# Altium project PCB1_Left Leg.PrjPcb
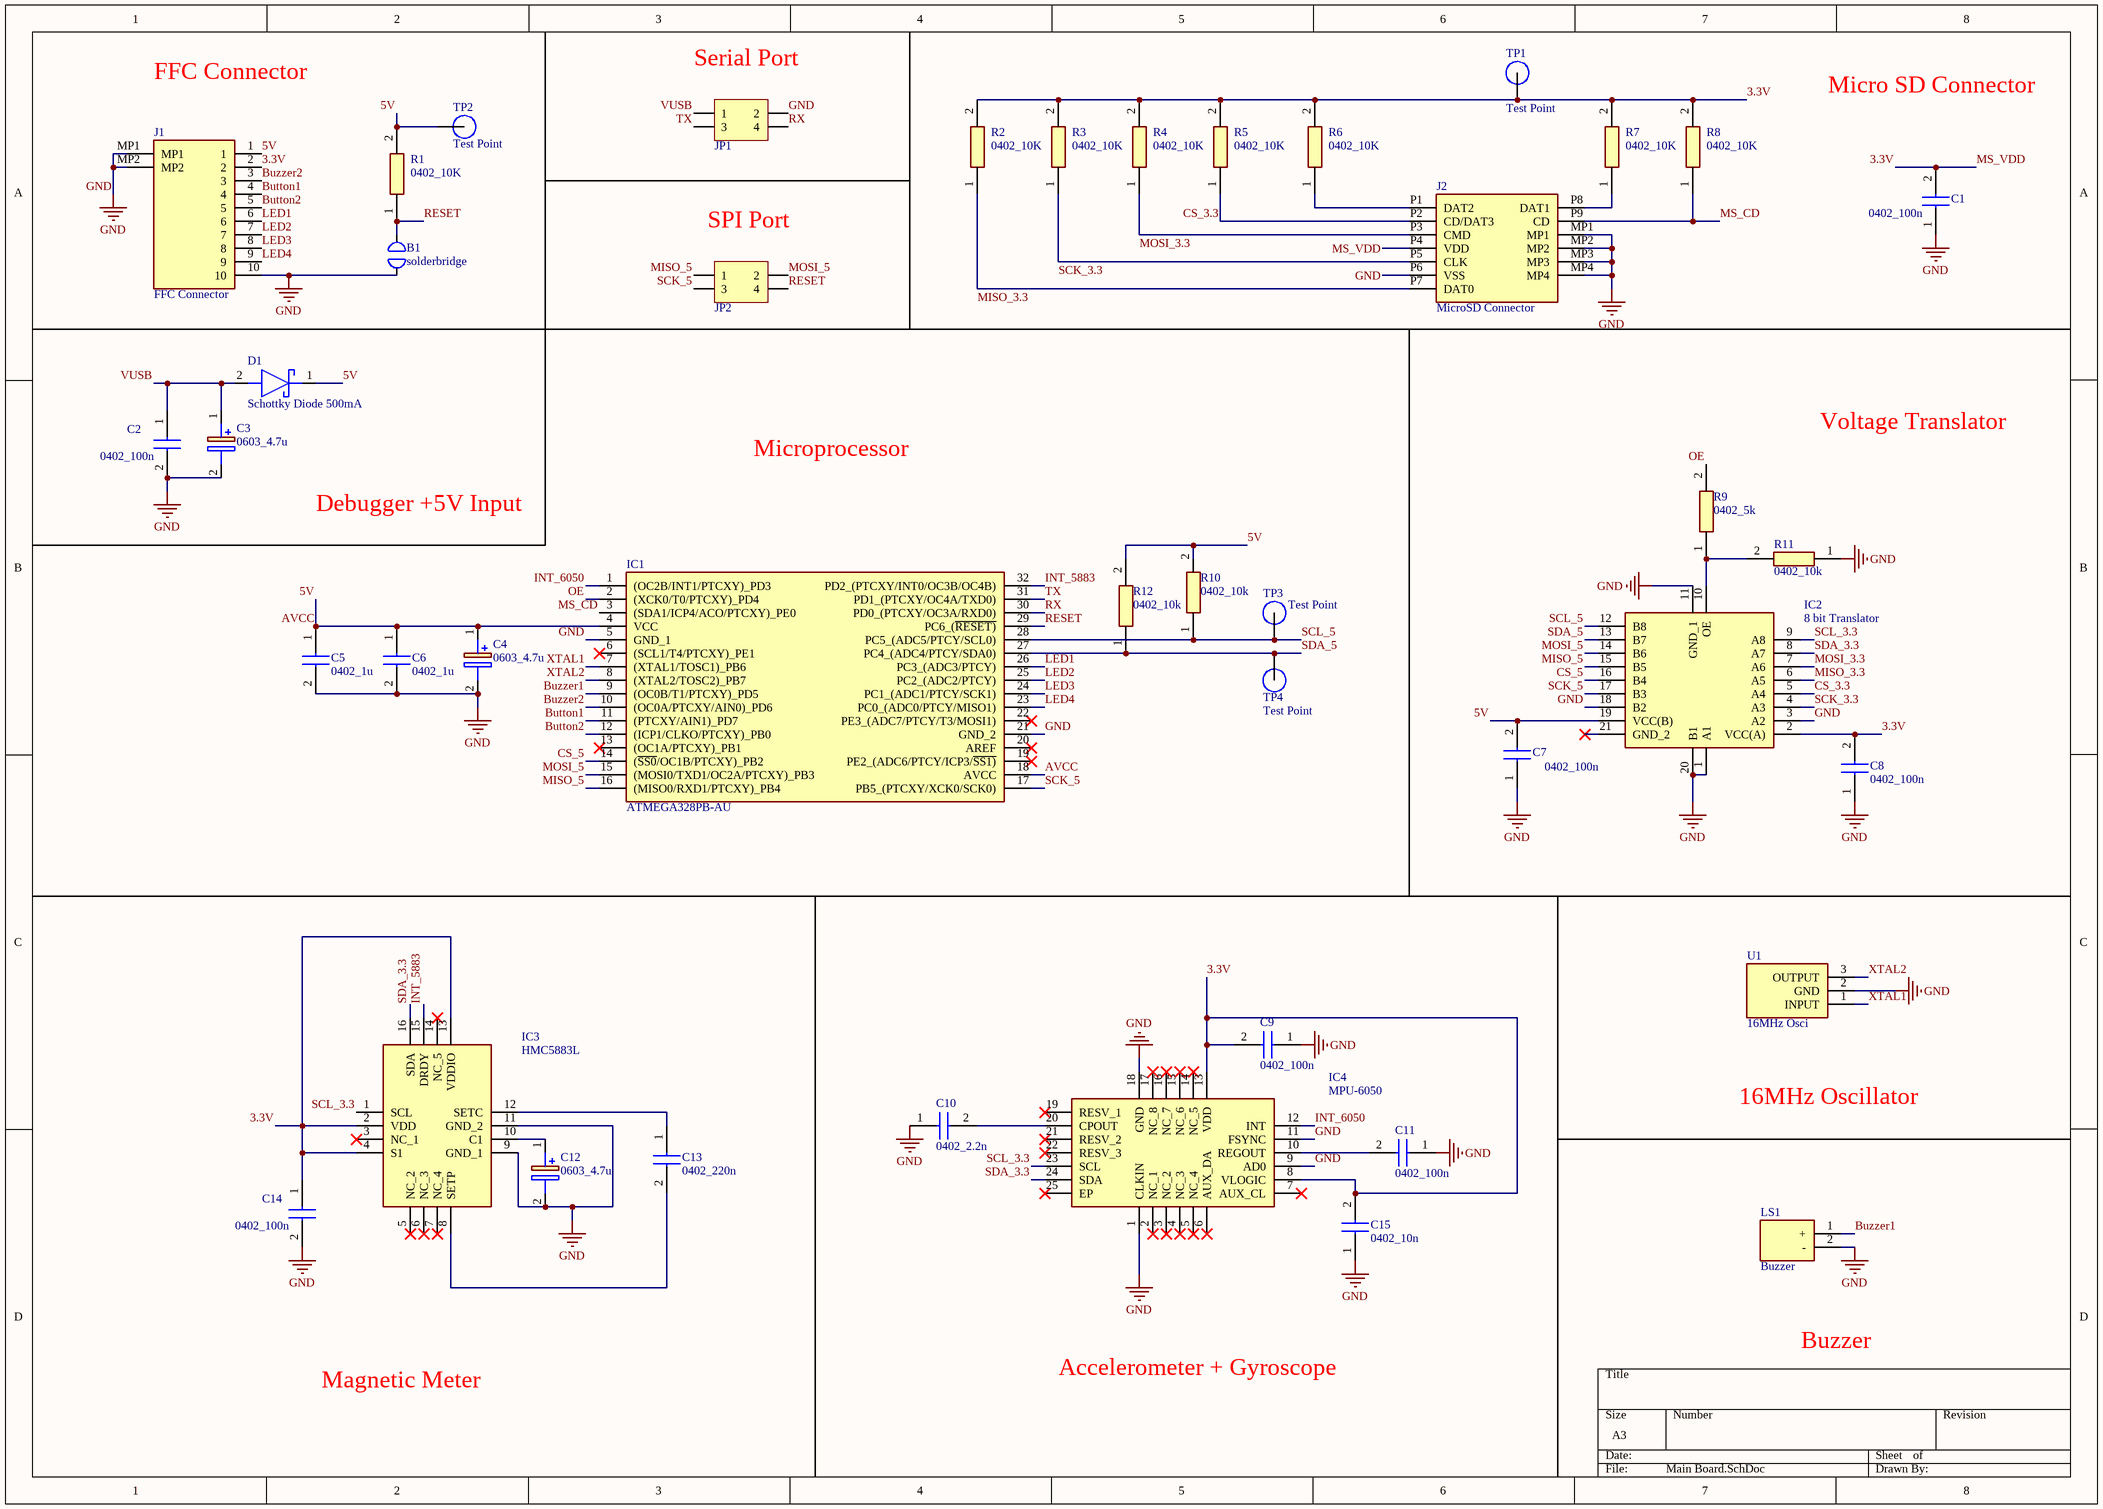
[diagram p0: Main Board.SchDoc]
1 sheet, 43 parts. Net scope: global (net labels, ports and power ports of the same name join across sheets).
Board file: PCB1_Left Leg.PcbDoc

## Sheet Main Board.SchDoc
size A3

### Parts
B1  solderbridge  [Solderbridge]
C1  0402_100n  [CAPC1005X55N]
C2  0402_100n  [CAPC1005X55N]
C3  0603_4.7u  [CAPPM168X90N]
C4  0603_4.7u  [CAPPM168X90N]
C5  0402_1u  [CAPC1005X55N]
C6  0402_1u  [CAPC1005X55N]
C7  0402_100n  [CAPC1005X55N]
C8  0402_100n  [CAPC1005X55N]
C9  0402_100n  [CAPC1005X55N]
C10  0402_2.2n  [CAPC1005X55N]
C11  0402_100n  [CAPC1005X55N]
C12  0603_4.7u  [CAPPM168X90N]
C13  0402_220n  [CAPC1005X55N]
C14  0402_100n  [CAPC1005X55N]
C15  0402_10n  [CAPC1005X55N]
D1  Schottky Diode 500mA  [DIOC1709X85N]
IC1  ATMEGA328PB-AU  [QFP80P900X900X120-32N]
IC2  8 bit Translator  [NXB0108BQX]
IC3  HMC5883L  [HMC5883L]
IC4  MPU-6050  [MPU_6050]
J1  FFC Connector  [528921033]
J2  MicroSD Connector  [MEM20750014001A]
JP1  Header2X2  [HDR2.54-LI-2x2P]  (value not drawn)
JP2  Header2X2  [HDR2.54-LI-2x2P]  (value not drawn)
LS1  Buzzer  [CPT1212381SMTTR]
R1  0402_10K  [0402_R]
R2  0402_10K  [0402_R]
R3  0402_10K  [0402_R]
R4  0402_10K  [0402_R]
R5  0402_10K  [0402_R]
R6  0402_10K  [0402_R]
R7  0402_10K  [0402_R]
R8  0402_10K  [0402_R]
R9  0402_5k  [0402_R]
R10  0402_10k  [0402_R]
R11  0402_10k  [0402_R]
R12  0402_10k  [0402_R]
TP1  Test Point  [TP_SMD_D1.0mm]
TP2  Test Point  [TP_SMD_D1.0mm]
TP3  Test Point  [TP_SMD_D1.0mm]
TP4  Test Point  [TP_SMD_D1.0mm]
U1  16MHz Osci  [CSTNE16M0V530000R0]

### Nets
GND: B1.2 C1.1 C2.2 C3.2(-) C4.2(-) C5.2 C6.2 C7.1 C8.1 C9.1 C10.1 C11.1 C12.2(-) C14.2 C15.1 IC1.5(GND_1) IC1.21(GND_2) IC2.1(A1) IC2.3(A2) IC2.11(GND_1) IC2.18(B2) IC2.20(B1) IC3.9(GND_1) IC3.11(GND_2) IC4.1(CLKIN) IC4.9(AD0) IC4.11(FSYNC) IC4.18(GND) J1.10 J1.MP1 J1.MP2 J2.MP1 J2.MP2 J2.MP3 J2.MP4 J2.P6(VSS) JP1.2 LS1.2(-) R11.1 U1.2(GND)
3.3V: C1.2 C8.2 C9.2 C14.1 C15.2 IC2.2(VCC(A)) IC3.2(VDD) IC3.4(S1) IC3.13(VDDIO) IC4.8(VLOGIC) IC4.13(VDD) J1.2 J2.P4(VDD) R2.2 R3.2 R4.2 R5.2 R6.2 R7.2 R8.2 TP1.1  [also labelled MS_VDD]
5V: C4.1(+) C5.1 C6.1 C7.2 D1.1(K) IC1.4(VCC) IC1.18(AVCC) IC2.19(VCC(B)) J1.1 R1.2 R10.2 R12.2 TP2.1  [also labelled AVCC]
Button1: IC1.11((PTCXY/AIN1)_PD7) J1.4
Button2: IC1.12((ICP1/CLKO/PTCXY)_PB0) J1.5
Buzzer1: IC1.9((OC0B/T1/PTCXY)_PD5) LS1.1(+)
Buzzer2: IC1.10((OC0A/PTCXY/AIN0)_PD6) J1.3
CS_3.3: IC2.5(A4) J2.P2(CD/DAT3) R5.1
CS_5: IC1.14((~{SS0}/OC1B/PTCXY)_PB2) IC2.16(B4)
INT_5883: IC1.32(PD2_(PTCXY/INT0/OC3B/OC4B)) IC3.15(DRDY)
INT_6050: IC1.1((OC2B/INT1/PTCXY)_PD3) IC4.12(INT)
LED1: IC1.26(PC3_(ADC3/PTCY)) J1.6
LED2: IC1.25(PC2_(ADC2/PTCY)) J1.7
LED3: IC1.24(PC1_(ADC1/PTCY/SCK1)) J1.8
LED4: IC1.23(PC0_(ADC0/PTCY/MISO1)) J1.9
MISO_3.3: IC2.6(A5) J2.P7(DAT0) R2.1
MISO_5: IC1.16((MISO0/RXD1/PTCXY)_PB4) IC2.15(B5) JP2.1
MOSI_3.3: IC2.7(A6) J2.P3(CMD) R4.1
MOSI_5: IC1.15((MOSI0/TXD1/OC2A/PTCXY)_PB3) IC2.14(B6) JP2.2
MS_CD: IC1.3((SDA1/ICP4/ACO/PTCXY)_PE0) J2.P9(CD) R8.1
OE: IC1.2((XCK0/T0/PTCXY)_PD4) R9.2
RESET: B1.1 IC1.29(PC6_(~{RESET)}) JP2.4 R1.1
RX: IC1.30(PD0_(PTCXY/OC3A/RXD0)) JP1.4
SCK_3.3: IC2.4(A3) J2.P5(CLK) R3.1
SCK_5: IC1.17(PB5_(PTCXY/XCK0/SCK0)) IC2.17(B3) JP2.3
SCL_3.3: IC2.9(A8) IC3.1(SCL) IC4.23(SCL)
SCL_5: IC1.28(PC5_(ADC5/PTCY/SCL0)) IC2.12(B8) R10.1 TP3.1
SDA_3.3: IC2.8(A7) IC3.16(SDA) IC4.24(SDA)
SDA_5: IC1.27(PC4_(ADC4/PTCY/SDA0)) IC2.13(B7) R12.1 TP4.1
TX: IC1.31(PD1_(PTCXY/OC4A/TXD0)) JP1.3
VUSB: C2.1 C3.1(+) D1.2(A) JP1.1
XTAL1: IC1.7((XTAL1/TOSC1)_PB6) U1.1(INPUT)
XTAL2: IC1.8((XTAL2/TOSC2)_PB7) U1.3(OUTPUT)
NetC10_2: C10.2 IC4.20(CPOUT)
NetC11_2: C11.2 IC4.10(REGOUT)
NetC12_1: C12.1(+) IC3.10(C1)
NetC13_1: C13.1 IC3.12(SETC)
NetC13_2: C13.2 IC3.8(SETP)
NetIC2_10: IC2.10(OE) R9.1 R11.2
NetJ2_P1: J2.P1(DAT2) R6.1
NetJ2_P8: J2.P8(DAT1) R7.1

Not connected (* = marked no-connect by the designer): IC1 6((SCL1/T4/PTCXY)_PE1)* 13((OC1A/PTCXY)_PB1)* 19(PE2_(ADC6/PTCY/ICP3/~{SS1)})* 20(AREF)* 22(PE3_(ADC7/PTCY/T3/MOSI1))*; IC2 21(GND_2)*; IC3 3(NC_1)* 5(NC_2)* 6(NC_3)* 7(NC_4)* 14(NC_5)*; IC4 2(NC_1)* 3(NC_2)* 4(NC_3)* 5(NC_4)* 6(AUX_DA)* 7(AUX_CL)* 14(NC_5)* 15(NC_6)* 16(NC_7)* 17(NC_8)* 19(RESV_1)* 21(RESV_2)* 22(RESV_3)* 25(EP)*

### Notes on the sheet
- FFC Connector
- (near JP1) Serial Port
- Micro SD Connector
- (near JP2) SPI Port
- Voltage Translator
- Debugger +5V Input
- Microprocessor
- 16MHz Oscillator
- Magnetic Meter
- Accelerometer + Gyroscope
- Buzzer

### Library data of the parts
C1 C2 C5-C11 C13-C15 = 0603_C: Capacitor; Manufacturer_Name: Vishay; Manufacturer_Part_Number: VJ0603HIFRQ1KIT; Datasheet Link: http://www.vishay.com/docs/45226/vj31xrohsautomlcc.pdf; Height: 0.97mm
C3 C4 C12 = 0603_Tan: Capacitor Polarised; Manufacturer_Name: Vishay; Manufacturer_Part_Number: TMCJ0J475MTRF; Datasheet Link: https://componentsearchengine.com/Datasheets/1/TMCJ0J475MTRF.pdf; Height: 0.9mm
D1 = Schottky Diode 500mA: Schottky Diode; Manufacturer_Name: Comchip Technology; Manufacturer_Part_Number: CDBU0520; Datasheet Link: https://componentsearchengine.com//CDBU0520.pdf; Height: 0.85mm; Mouser2 Part Number: 750-CDBU0520; Mouser2 Price/Stock: https://www.mouser.com/Search/Refine.aspx?Keyword=750-CDBU0520
IC1 = ATMEGA328PB-AU: Integrated Circuit; Manufacturer_Name: Microchip; Datasheet Link: https://componentsearchengine.com//ATMEGA328PB-AU.pdf; Height: 1.2mm; Mouser2 Part Number: 556-ATMEGA328PB-AU; Mouser2 Price/Stock: https://www.mouser.com/Search/Refine.aspx?Keyword=556-ATMEGA328PB-AU; Manufacturer_Part_Number: ATMEGA328PB-AU
IC2 = 8 bit Translator: Integrated Circuit; Manufacturer_Name: Nexperia; Datasheet Link: https://assets.nexperia.com/documents/data-sheet/NXB0108.pdf; Height: 1mm; Manufacturer_Part_Number: NXB0108BQX
IC3 = HMC5883L: Integrated Circuit; Manufacturer_Name: Honeywell; Datasheet Link: http://www.farnell.com/datasheets/1683374.pdf; Height: 0.9mm; Manufacturer_Part_Number: HMC5883L
IC4 = MPU-6050: Integrated Circuit; Manufacturer_Name: TDK; Datasheet Link: https://invensense.tdk.com/wp-content/uploads/2015/02/MPU-6000-Datasheet1.pdf; Height: 0.95mm; Manufacturer_Part_Number: MPU-6050
J1 = FFC Connector: Connector; Manufacturer_Name: Molex; Manufacturer_Part_Number: 52892-1033; Datasheet Link: https://componentsearchengine.com/Datasheets/2/52892-1033.pdf; Height: 2mm
J2 = MEM2075-00-140-01-A: Connector; Manufacturer_Name: GCT (GLOBAL CONNECTOR TECHNOLOGY); Height: 1.45mm; Manufacturer_Part_Number: MEM2075-00-140-01-A
JP1 JP2 = Header 2X2: BOM名称: 2*2P接插件; 版权归属: 源创客; 学习资源: www.ooocke.com
LS1 = Buzzer: Loudspeaker or Buzzer; Manufacturer_Name: CUI Inc.; Manufacturer_Part_Number: CPT-12123-81-SMT-TR; Datasheet Link: https://www.cuidevices.com/product/resource/cpt-12123-81-smt-tr.pdf; Height: 3.3mm
R1-R12 = 0402_R: Resistor; Manufacturer_Name: Panasonic; Manufacturer_Part_Number: ERA-2ARB472X; Datasheet Link: http://industrial.panasonic.com/cdbs/www-data/pdf/RDM0000/AOA0000C307.pdf; Height: 0.4mm
U1 = 16MHz Osci: Undefined or Miscellaneous; Manufacturer_Name: Murata Electronics; Datasheet Link: https://componentsearchengine.com//CSTNE16M0V530000R0.pdf; Height: 1mm; Mouser2 Part Number: 81-CSTNE16M0V530000R; Mouser2 Price/Stock: https://www.mouser.com/Search/Refine.aspx?Keyword=81-CSTNE16M0V530000R; Manufacturer_Part_Number: CSTNE16M0V530000R0